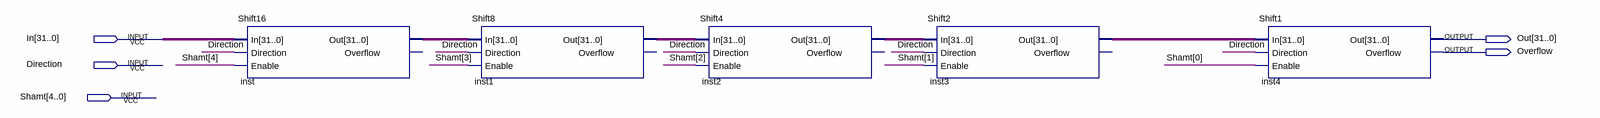
[diagram p0: schematic sheet]
// Quartus schematic Shift.bdf as structural Verilog: 5 symbols, 5 pins
module Shift (
  input  [31:0] In,
  input  Direction,
  input  [4:0] Shamt,
  output [31:0] Out,
  output Overflow
);

  wire [31:0] inst1_out, inst2_out, inst3_out, inst_out;

  Shift16 inst (.In(In), .Direction(Direction), .Enable(Shamt[4]), .Out(inst_out));  // open: Overflow
  Shift8 inst1 (.In(inst_out), .Direction(Direction), .Enable(Shamt[3]), .Out(inst1_out));  // open: Overflow
  Shift4 inst2 (.In(inst1_out), .Direction(Direction), .Enable(Shamt[2]), .Out(inst2_out));  // open: Overflow
  Shift2 inst3 (.In(inst2_out), .Direction(Direction), .Enable(Shamt[1]), .Out(inst3_out));  // open: Overflow
  Shift1 inst4 (.In(inst3_out), .Direction(Direction), .Enable(Shamt[0]), .Out(Out), .Overflow(Overflow));
endmodule
